# Altium schematic sheet MCU-ADDON.SchDoc: MCU-Add-On
size A4; Revision: 1
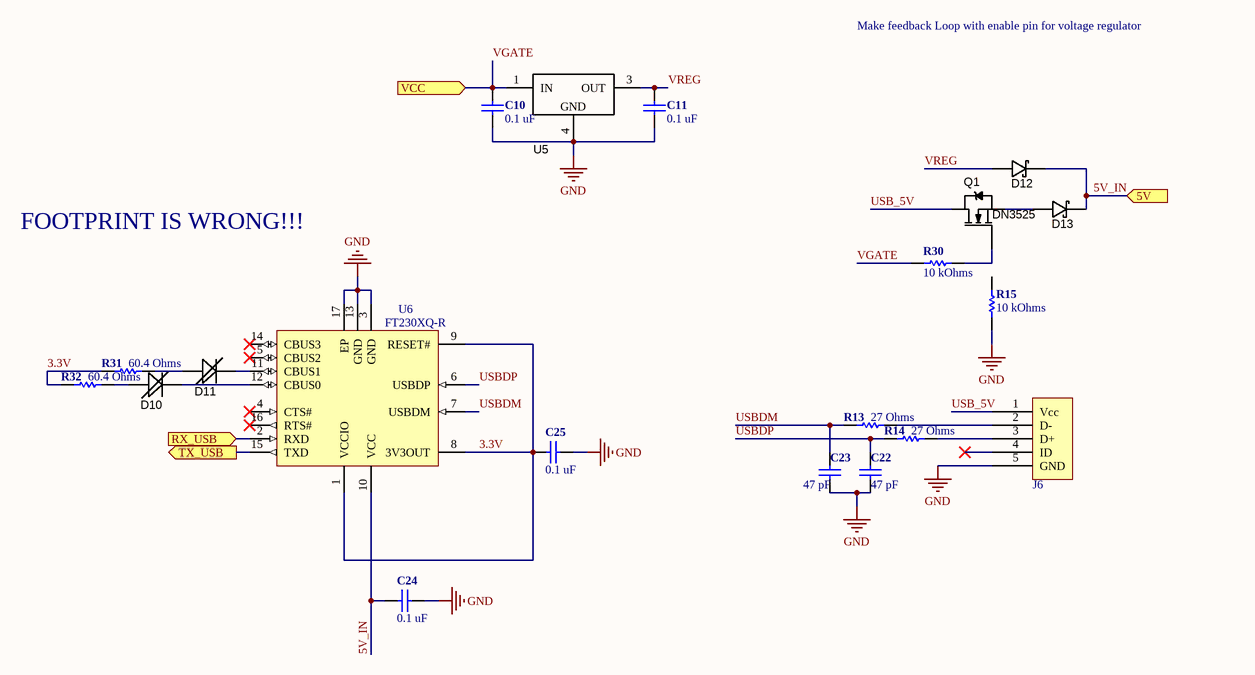
[diagram p0: MCU-ADDON.SchDoc]

## Parts
C10  0.1 uF  [CAP-0402(1005)-R]
C11  0.1 uF  [CAP-0402(1005)-R]
C22  47 pF  [CAP-0603(1608)-R]
C23  47 pF  [CAP-0603(1608)-R]
C24  0.1 uF  [CAP-0402(1005)-R]
C25  0.1 uF  [CAP-0402(1005)-R]
D10  Red  [LED-1206]  (value not drawn)
D11  Red  [LED-1206]  (value not drawn)
D12  MBR120VLSFT3G  [SOD-123FL]  (value not drawn)
D13  MBR120VLSFT3G  [SOD-123FL]  (value not drawn)
J6  USB  [USB_Connector_5P_MICRO_USB_FCI]  (value not drawn)
Q1  DN3525  [SOT89-3]
R13  27 Ohms  [R-0603(1608)-R]
R14  27 Ohms  [R-0603(1608)-R]
R15  10 kOhms  [R-0603(1608)-R]
R30  10 kOhms  [R-0603(1608)-R]
R31  60.4 Ohms  [R-0603(1608)-R]
R32  60.4 Ohms  [R-0603(1608)-R]
U5  FIXED 5V  [TO-252]  (value not drawn)
U6  FT230XQ-R  [QFN-16]

## Ports
5V, RX_USB (in), TX_USB (out), VCC

## Nets
GND: C10.2 C11.2 C22.2 C23.2 C24.2 C25.2 J6.5(GND) R15.1 U5.4(GND) U6.3(GND) U6.13(GND) U6.17(EP)
3.3V: C25.1 R31.1 R32.1 U6.1(VCCIO) U6.8(3V3OUT) U6.9(RESET#)
5V_IN: C24.1 D12.K D13.K U6.10(VCC) ; port 5V
RX_USB: U6.2(RXD) ; port RX_USB
TX_USB: U6.15(TXD) ; port TX_USB
USB_5V: J6.1(Vcc) Q1.2(D)
USBDM: C23.1 R13.1 U6.7(USBDM)
USBDP: C22.1 R14.1 U6.6(USBDP)
VGATE: C10.1 R30.1 U5.1(IN) ; port VCC
VREG: C11.1 D12.A U5.3(OUT)
NetD10_A: D10.A R32.2
NetD10_K: D10.K U6.12(CBUS0)
NetD11_A: D11.A R31.2
NetD11_K: D11.K U6.11(CBUS1)
NetD13_A: D13.A Q1.3(S)
NetJ6_2: J6.2(D-) R13.2
NetJ6_3: J6.3(D+) R14.2
NetQ1_1: Q1.1(G) R30.2

Not connected (* = marked no-connect by the designer): J6 4(ID)*; R15 2; U6 4(CTS#)* 5(CBUS2)* 14(CBUS3)* 16(RTS#)*

## Notes on the sheet
- Make feedback Loop with enable pin for voltage regulator
- FOOTPRINT IS WRONG!!!
- Title
- Size:
- Date:
- A4
- Number:
- Time:
- Revision:
- Sheet
- of
- File:

## Library data of the parts
C10 C11 C24 C25 = CAP- 0.1 uF- 16 V-CER-0402(1005): CAP CER 0.1 UF 16V 5% X7R 0402; Manufacturer: Yageo; Manufacturer Part Number: CC0402KRX7R7BB104; Tolerance: 10 %; Type: Multilayer Ceramic Chip Capacitor; Voltage Rating DC: 16 VDC; Supplier 1: Mouser; RoHS: RoHS Compliant By Exemption; Category: Multilayer Ceramic Capacitors MLCC - SMD/SMT; Stock 1: 655262; Pricing 1: 1=0.100, 10=0.009, 100=0.004, 1000=0.003, 2500=0.002, 10000=0.002 (USD); Capacitance: 0.1 uF; Package / Case: 0402 (1005 metric); Packaging: Reel; Product: General Type MLCCs; Termination Style: SMD/SMT; Brand: Yageo; Case Code - in: 0402; Case Code - mm: 1005; Dielectric: X7R; Maximum Operating Temperature: + 125 C; Minimum Operating Temperature: - 55 C; Standard Pack Qty: 10000; RoHS - Mouser: E; Minimum Order Quantity: 1; Reeling: True; ComponentLink1URL: http://www.mouser.com/ds/2/447/UPY-GPHC_X7R_6.3V-to-50V_8-12304.pdf; ComponentLink1Description: http://www.mouser.com/ds/2/447/UPY-GPHC_X7R_6.3V-to-50V_8-12304.pdf; Supplier Part Number 1: 603-CC402KRX7R7BB104
C22 C23 = CAP- 47 pF- 50 V-CER-0603(1608): CAP CER 47 pF 50V 5% C0G 0603; Manufacturer: Yageo; Manufacturer Part Number: CC0603JRNPO9BN470; Type: Multilayer Ceramic Chip Capacitor; Voltage Rating DC: 50 VDC; Dielectric: C0G (NP0); RoHS: RoHS Compliant; Category: Multilayer Ceramic Capacitors MLCC - SMD/SMT; Capacitance: 47 pF; Tolerance: 5 %; Package / Case: 0603 (1608 metric); Supplier 1: Mouser; Stock 1: 0; Pricing 1: 1=0.100, 10=0.021, 100=0.009, 1000=0.007, 4000=0.005, 48000=0.004, 100000=0.003 (USD); Length: 1.6 mm; Packaging: Reel; Product: General Type MLCCs; Termination Style: SMD/SMT; Width: 0.8 mm; Brand: Yageo; Case Code - in: 0603; Case Code - mm: 1608; Maximum Operating Temperature: + 125 C; Minimum Operating Temperature: - 55 C; Standard Pack Qty: 4000; RoHS - Mouser: E; Minimum Order Quantity: 1; Reeling: True; ComponentLink1URL: http://www.mouser.com/ds/2/447/UPY-GP_NP0_16V-to-50V_8-3714.pdf; ComponentLink1Description: http://www.mouser.com/ds/2/447/UPY-GP_NP0_16V-to-50V_8-3714.pdf; Supplier Part Number 1: 603-CC603JRNPO9BN470
D10 D11 = LED_SMD_RED_0805: LED, 0805 SMD, Red; Manufacturer: Kingbright; Manufacturer Part Number: APTD3216SURCK; Lens Color/Style: Water Clear; LED Size: 3.2 mm x 1.6 mm; Luminous Intensity: 1000 mcd; Viewing Angle: 50 deg; If - Forward Current: 20 mA; Vf - Forward Voltage: 1.95 V; Wavelength/Color Temperature: 630 nm; Package / Case: 1206; Supplier 1: Mouser; RoHS: RoHS Compliant; Category: Standard LEDs - SMD; Stock 1: 52291; Pricing 1: 1=0.270, 10=0.169, 100=0.125, 1000=0.103, 2000=0.092, 10000=0.084, 24000=0.075, 50000=0.071, 100000=0.068 (USD); Illumination Color: Red; Packaging: Reel; Brand: Kingbright; Mounting Style: SMD/SMT; Maximum Operating Temperature: + 85 C; Minimum Operating Temperature: - 40 C; Product Category: LED SMD Super Bright; Standard Pack Qty: 2000; RoHS - Mouser: Y; Minimum Order Quantity: 1; Reeling: True; ComponentLink1URL: http://www.mouser.com/ds/2/216/APTD3216SURCK-65552.pdf; ComponentLink1Description: http://www.mouser.com/ds/2/216/APTD3216SURCK-65552.pdf; Supplier Part Number 1: 604-APTD-3216SURCK
D12 D13 = DIODE_SCHOTTKY: Diode Schottky SMD 20V 1A SMD; Manufacturer: ON Semiconductor; Configuration: Single; Ifsm - Forward Surge Current: 45 A; Ir - Reverse Current: 600 uA; Vf - Forward Voltage: 0.34 V; Package / Case: SOD-123FL; Supplier 1: Mouser; Supplier Part Number 1: 863-MBR120VLSFT3G; Manufacturer Part Number: MBR120VLSFT3G; RoHS: RoHS Compliant; Category: Schottky Diodes & Rectifiers; Stock 1: 22244; Pricing 1: 1=0.360, 10=0.279, 100=0.151, 1000=0.114, 2500=0.098, 10000=0.091, 20000=0.084, 50000=0.081, 100000=0.076 (USD); Packaging: Reel; Product: Schottky Diodes; Series: MBR120VLSF; Technology: Si; Brand: ON Semiconductor; Mounting Style: SMD/SMT; If - Forward Current: 1 A; Maximum Operating Temperature: + 125 C; Minimum Operating Temperature: - 65 C; Product Category: Diodes- Schottky; Standard Pack Qty: 10000; Vrrm - Repetitive Reverse Voltage: 20 V; RoHS - Mouser: Y; Minimum Order Quantity: 1; Reeling: True; ComponentLink1URL: http://www.mouser.com/ds/2/308/MBR120VLSFT1-D-107081.pdf; ComponentLink1Description: http://www.mouser.com/ds/2/308/MBR120VLSFT1-D-107081.pdf
J6 = USB: USB_Connector_5P_MICRO_USB_FCI; Manufacturer: FCI; Manufacturer Part Number: 10118194-0001LF; Connector Type: Micro USB Type B receptacle; Current Rating: 1.8 A; Gender: Female; Mounting Angle: Right; Number of Contacts: 5 Contact; Insulation Resistance: 1000 MOhms; Supplier 1: Mouser; RoHS: RoHS Compliant; Category: USB Connectors; Stock 1: 17001; Pricing 1: 1=0.410, 10=0.396, 100=0.278, 500=0.238, 1200=0.198, 2400=0.181, 4800=0.170, 9600=0.159, 24000=0.153 (USD); Color: Black; Contact Plating: Gold; Operating Temperature Range: - 55 C to + 85 C; Packaging: Reel; Product: Micro USB Type B Connectors; Termination Style: SMD/SMT; Brand: FCI; Contact Material: Copper Alloy; Flammability Rating: UL 94 V-0; Standard: USB 2.0; Standard Pack Qty: 9600; RoHS - Mouser: Y; Minimum Order Quantity: 1; Reeling: True; ComponentLink1URL: http://www.mouser.com/ds/2/154/10118194AC-197217.pdf; ComponentLink1Description: http://www.mouser.com/ds/2/154/10118194AC-197217.pdf; Supplier Part Number 1: 649-10118194-0001LF
Q1 = DN3525N8-G: MOSFET N-Channel DEPLETION SMD; Manufacturer: Microchip Technology; Configuration: Single; Transistor Type: 1 N-Channel; Number of Channels: 1 Channel; Fall Time: 25 ns; Id - Continuous Drain Current: 360 mA; Pd - Power Dissipation: 1.6 W; Rds On - Drain-Source Resistance: 6 Ohms; Typical Turn-On Delay Time: 20 ns; Vds - Drain-Source Breakdown Voltage: 250 V; Vgs - Gate-Source Voltage: 20 V; Package / Case: SOT-89-3; Supplier 1: Mouser; Supplier Part Number 1: 689-DN3525N8-G; Manufacturer Part Number: DN3525N8-G; RoHS: RoHS Compliant; Category: MOSFET; Stock 1: 34759; Pricing 1: 1=0.720, 10=0.650, 25=0.540, 100=0.490, 2000=0.490 (USD); Packaging: Reel; Brand: Microchip Technology; Mounting Style: SMD/SMT; Transistor Polarity: N-Channel; Channel Mode: Depletion; Maximum Operating Temperature: + 150 C; Minimum Operating Temperature: - 55 C; Product Category: MOSFETs - Depletion Mode N-Channel; Rise Time: 25 ns; Standard Pack Qty: 2000; Typical Turn-Off Delay Time: 25 ns; RoHS - Mouser: Y; Minimum Order Quantity: 1; Reeling: True
R13 R14 = R-27-100 mW-0603: RES 27 OHM 100 mW  SMD; Manufacturer: Yageo; Manufacturer Part Number: RC0603JR-0727RL; Power Rating: 100 mW; Temperature Coefficient: 100 PPM / C; Tolerance: 5 %; Voltage Rating: 75 V; Supplier 1: Mouser; RoHS: RoHS Compliant; Category: Thick Film Resistors - SMD; Stock 1: 21649; Pricing 1: 1=0.100, 10=0.008, 100=0.003, 1000=0.002, 5000=0.002, 50000=0.001 (USD); Height: 0.45 mm; Length: 1.6 mm; Operating Temperature Range: - 55 C to + 155 C; Package / Case: 0603 (1608 metric); Packaging: Reel; Product: Thick Film Resistors General Purpose; Resistance: 27 Ohms; Series: RC; Termination Style: SMD/SMT; Type: General Purpose Chip Resistor Surface Mount; Width: 0.8 mm; Brand: Yageo; Case Code - in: 0603; Case Code - mm: 1608; Product Category: 0603 SMD Chip Resistors; Standard Pack Qty: 5000; RoHS - Mouser: Y; Minimum Order Quantity: 1; Reeling: True; ComponentLink1URL: http://www.mouser.com/ds/2/447/RC0603-272842.pdf; ComponentLink1Description: http://www.mouser.com/ds/2/447/RC0603-272842.pdf; Supplier Part Number 1: 603-RC0603JR-0727RL
R15 R30 = R-10k-100mW-0603: RES 10k OHM 1/10W 0603 SMD; Manufacturer: Yageo; Manufacturer Part Number: RC0603FR-0710KL; Power Rating: 100 mW; Temperature Coefficient: 100 PPM / C; Tolerance: 1 %; Voltage Rating: 75 V; RoHS: RoHS Compliant; Category: Thick Film Resistors - SMD; Packaging: Reel; Resistance: 10 kOhms; Package / Case: 0603 (1608 metric); Height: 0.45 mm; Supplier 1: Mouser; Stock 1: 240719; Pricing 1: 1=0.100, 10=0.010, 100=0.003, 1000=0.002, 5000=0.002, 10000=0.001 (USD); Length: 1.6 mm; Operating Temperature Range: - 55 C to + 155 C; Product: Thick Film Resistors General Purpose; Series: RC; Termination Style: SMD/SMT; Type: General Purpose Chip Resistor Surface Mount; Width: 0.8 mm; Brand: Yageo; Case Code - in: 0603; Case Code - mm: 1608; Product Category: 0603 SMD Chip Resistors; Standard Pack Qty: 5000; RoHS - Mouser: Y; Minimum Order Quantity: 1; Reeling: True; ComponentLink1URL: http://www.mouser.com/ds/2/447/RC0603-272842.pdf; ComponentLink1Description: http://www.mouser.com/ds/2/447/RC0603-272842.pdf; Supplier Part Number 1: 603-RC0603FR-0710KL
R31 R32 = R-60.4-100mW-0805: RES 60.4 OHM 100 mW  SMD; Manufacturer: Yageo; Manufacturer Part Number: RC0603FR-0760R4L; Power Rating: 100 mW; Temperature Coefficient: 100 PPM / C; Tolerance: 1 %; Voltage Rating: 75 V; RoHS: RoHS Compliant; Category: Thick Film Resistors - SMD; Packaging: Reel; Resistance: 60.4 Ohms; Package / Case: 0603 (1608 metric); Height: 0.45 mm; Supplier 1: Mouser; Stock 1: 5823; Pricing 1: 1=0.100, 10=0.010, 100=0.003, 1000=0.002, 5000=0.002, 10000=0.001 (USD); Length: 1.6 mm; Operating Temperature Range: - 55 C to + 155 C; Product: Thick Film Resistors General Purpose; Series: RC; Termination Style: SMD/SMT; Type: General Purpose Chip Resistor Surface Mount; Width: 0.8 mm; Brand: Yageo; Case Code - in: 0603; Case Code - mm: 1608; RoHS - Mouser: Y; Minimum Order Quantity: 1; Reeling: True; ComponentLink1URL: http://www.mouser.com/ds/2/447/RC0603-272842.pdf; ComponentLink1Description: http://www.mouser.com/ds/2/447/RC0603-272842.pdf; Supplier Part Number 1: 603-RC0603FR-0760R4L
U5 = MC78M05CDTRKG: Voltage Regulator IC, DPAK SMD, MC78M05CDTRKG; Manufacturer: ON Semiconductor; Input Voltage MAX: 35 V; Number of Outputs: 1; Output Current: 500 mA; PSRR / Ripple Rejection - Typ: 80 dB; Input Voltage MIN: 7 V; Line Regulation: 50 mV; Load Regulation: 100 mV; Polarity: Positive; Package / Case: TO-252-3 (DPAK); Supplier 1: Mouser; Supplier Part Number 1: 863-MC78M05CDTRKG; Manufacturer Part Number: MC78M05CDTRKG; RoHS: RoHS Compliant; Category: Linear Voltage Regulators; Stock 1: 26245; Pricing 1: 1=0.470, 10=0.353, 100=0.222, 1000=0.166, 2500=0.142, 10000=0.132, 25000=0.125, 50000=0.119, 100000=0.116 (USD); Output Type: Fixed; Output Voltage: 5 V; Packaging: Reel; Series: MC78M05; Brand: ON Semiconductor; Mounting Style: SMD/SMT; Maximum Operating Temperature: + 125 C; Minimum Operating Temperature: 0 C; Product Category: Linear Regulators- General Purpose; Standard Pack Qty: 2500; RoHS - Mouser: Y; Minimum Order Quantity: 1; Reeling: True; ComponentLink1URL: http://www.mouser.com/ds/2/308/MC78M00-D-88441.pdf; ComponentLink1Description: http://www.mouser.com/ds/2/308/MC78M00-D-88441.pdf
U6 = FT230XQ-R: USB to Basic UART Interface Chip, UHCI/OHCI/EHCI Compatible, USB 2.0 Compatible, -40 to +85 degC, 16-Pin QFN, Pb-Free, Tape and Reel; Manufacturer: FTDI; Data Rate: 480 Mb/s, 12 Mb/s; Speed: High-Speed; Interface Type: UART, USB; Operating Supply Current: 6.5 mA to 8.3 mA; Operating Supply Voltage: 2.97 V to 5.5 V; PackagingOptionsScrubbed: FT230XQT; ComponentLink1Description: http://www.mouser.com/ds/2/163/DS_FT230X-5395.pdf; ComponentLink1URL: http://www.mouser.com/ds/2/163/DS_FT230X-5395.pdf; Supplier 1: Mouser; Manufacturer Part Number: FT230XQ-R; RoHS: RoHS Compliant; Category: USB Interface IC; Stock 1: 69254; Pricing 1: 1=2.04, 25=1.97, 100=1.90, 250=1.71, 500=1.54, 1000=1.46, 2500=1.38, 5000=1.38 (USD); Package / Case: QFN-16; Packaging: Reel; Product: USB Bridge Controllers; Series: FT230; Type: Bridge, USB to UART; Brand: FTDI; Mounting Style: SMD/SMT; Maximum Operating Temperature: + 85 C; Standard: USB 2.0; Standard Pack Qty: 5000; Tradename: X-Chip; RoHS - Mouser: Y; Minimum Order Quantity: 1; Reeling: True; Supplier Part Number 1: 895-FT230XQ-R